# EAGLE design sensornode (EAGLE 6.4)
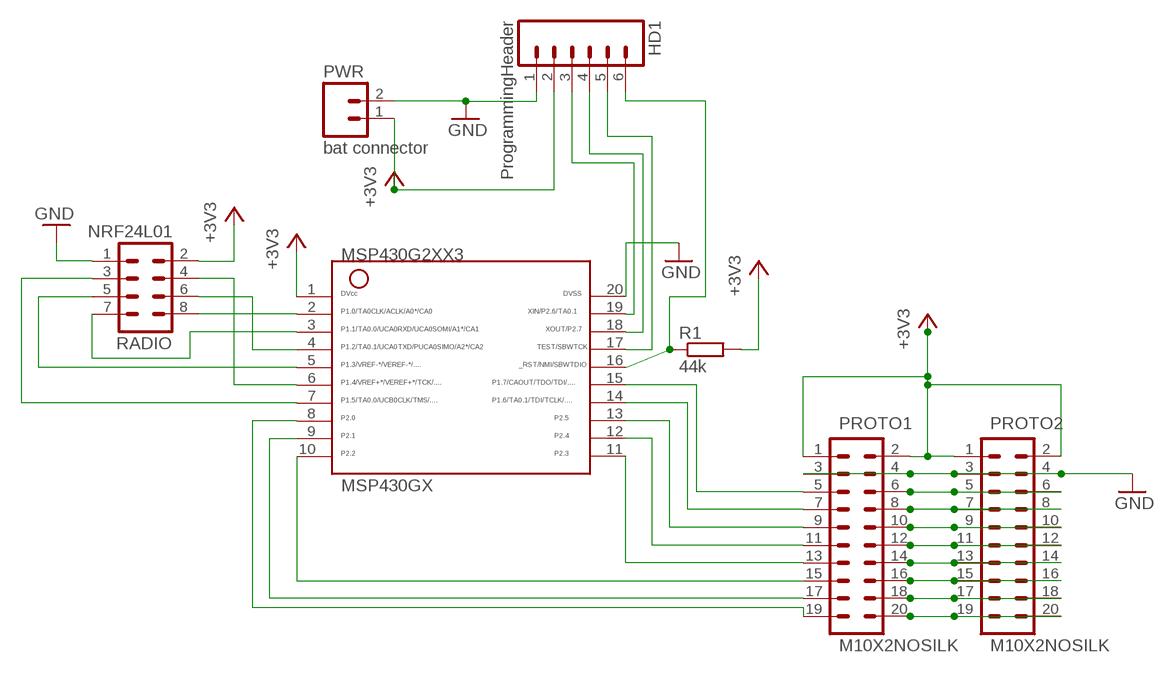
[diagram p0: schematic, sheet 1]

## Parts
HD1  ProgrammingHeader  M06SIP  [1X06]
MSP430GX  G2XX3---N20  [N20]
PROTO1  M10X2NOSILK  [2X10_NOSILK]
PROTO2  M10X2NOSILK  [2X10_NOSILK]
PWR  bat connector  M025MM  [SCREWTERMINAL-5MM-2]
R1  44k  R-EU_0207/10  [0207/10]
RADIO  NRF24L01  MA04-2  [MA04-2]

## Nets
+3V3: HD1.2 MSP430GX.1 PROTO1.1 PROTO1.2 PROTO2.1 PROTO2.2 PWR.1 R1.2 RADIO.2
GND: HD1.1 MSP430GX.20 PROTO1.3 PROTO1.4 PROTO2.3 PROTO2.4 PWR.2 RADIO.1
N$1: MSP430GX.6 RADIO.4
N$2: HD1.6 MSP430GX.16 R1.1
N$3: HD1.3 MSP430GX.19
N$4: MSP430GX.7 RADIO.3
N$5: MSP430GX.8 PROTO1.19
N$6: MSP430GX.5 RADIO.5
N$7: MSP430GX.4 RADIO.6
N$8: MSP430GX.3 RADIO.7
N$9: MSP430GX.9 PROTO1.17
N$10: MSP430GX.10 PROTO1.15
N$11: MSP430GX.11 PROTO1.13
N$12: MSP430GX.12 PROTO1.11
N$13: MSP430GX.13 PROTO1.9
N$14: MSP430GX.14 PROTO1.7
N$15: MSP430GX.15 PROTO1.5
N$16: MSP430GX.2 RADIO.8
N$17: HD1.4 MSP430GX.18
N$18: HD1.5 MSP430GX.17
N$19: PROTO1.6 PROTO2.5 PROTO2.6
N$20: PROTO1.8 PROTO2.7 PROTO2.8
N$21: PROTO1.10 PROTO2.9 PROTO2.10
N$22: PROTO1.12 PROTO2.11 PROTO2.12
N$23: PROTO1.14 PROTO2.13 PROTO2.14
N$24: PROTO1.16 PROTO2.15 PROTO2.16
N$25: PROTO1.18 PROTO2.17 PROTO2.18
N$26: PROTO1.20 PROTO2.19 PROTO2.20

## Library data of the parts
HD1 = SparkFun-Connectors:M06: Header 6 Standard 6-pin 0.1" header. Use with straight break away headers (SKU : PRT-00116), right angle break away headers (PRT-00553), swiss pins (PRT-00743), machine pins (PRT-00117), and female headers (PRT-00115). Molex polarized connector foot print use with SKU : PRT-08094 with associated crimp pins and housings. NOTES ON THE VARIANTS LOCK and LOCK_LONGPADS... This footprint was designed to help hold the alignment of a through-hole component (i.e. 6-pin header) while soldering it into place. You may notice that each hole has been shifted either up or down by 0.005 of an inch from it's more standard position (which is a perfectly straight line). This slight alteration caused the pins (the squares in the middle) to touch the edges of the holes. Because they are alternating, it causes a "brace" to hold the component in place. 0.005 has proven to be the perfect amount of "off-center" position when using our standard breakaway headers. Although looks a little odd when you look at the bare footprint, once you have a header in there, the alteration is very hard to notice. Also, if you push a header all the way into place, it is covered up entirely on the bottom side. This idea of altering the position of holes to aid alignment will be further integrated into the Sparkfun Library for other footprints. It can help hold any component with 3 or more connection pins.
MSP430GX = TI_MSP430_v16:G2XX3---N20: MSP430G2XX1 PDIP (N) 20 Pin Package
PROTO1 PROTO2 = SparkFun-Connectors:M10X2: This was SPECIALLY designed to be used with our Graphic LCD Backpack. Be sure you want to use this! It is not only staggered on each line of header holes, but IT IS ALSO offset of the center point of the top and bottom lines by 5 mil. This causes the headers to lock into place on the "standard" footprint on the LCD screen. The extra squares on the tdocu layer are there simply to reference other pins (if you were to actually populate a longer header than ten long - this is what we do with the backpacks).
PWR = SparkFun-Connectors:M02: Header 2 Standard 2-pin 0.1" header. Use with straight break away headers (SKU : PRT-00116), right angle break away headers (PRT-00553), swiss pins (PRT-00743), machine pins (PRT-00117), and female headers (PRT-00115). Molex polarized connector foot print use with SKU : PRT-08233 with associated crimp pins and housings.
R1 = resistor:R-EU_: RESISTOR, European symbol
RADIO = con-lstb:MA04-2: PIN HEADER; OC_FARNELL: unknown; OC_NEWARK: unknown

## Board
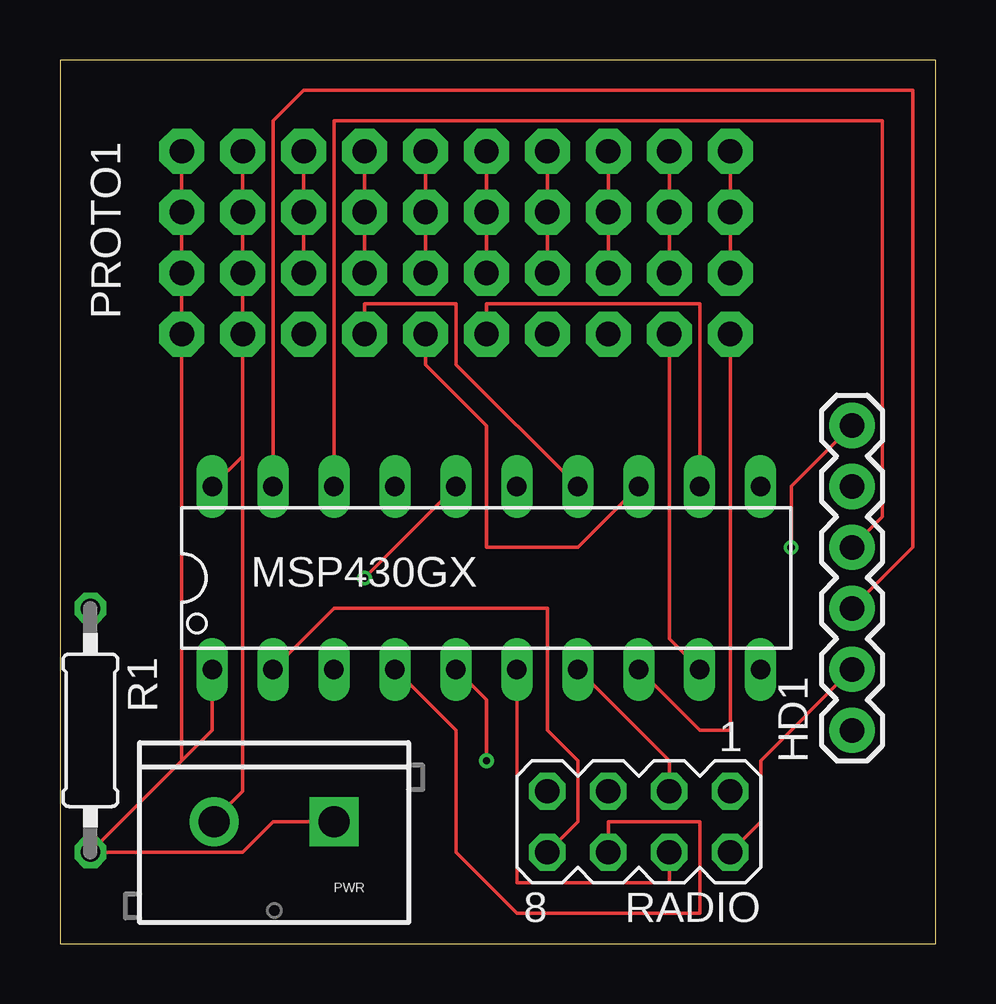
[diagram p1: board, top side]
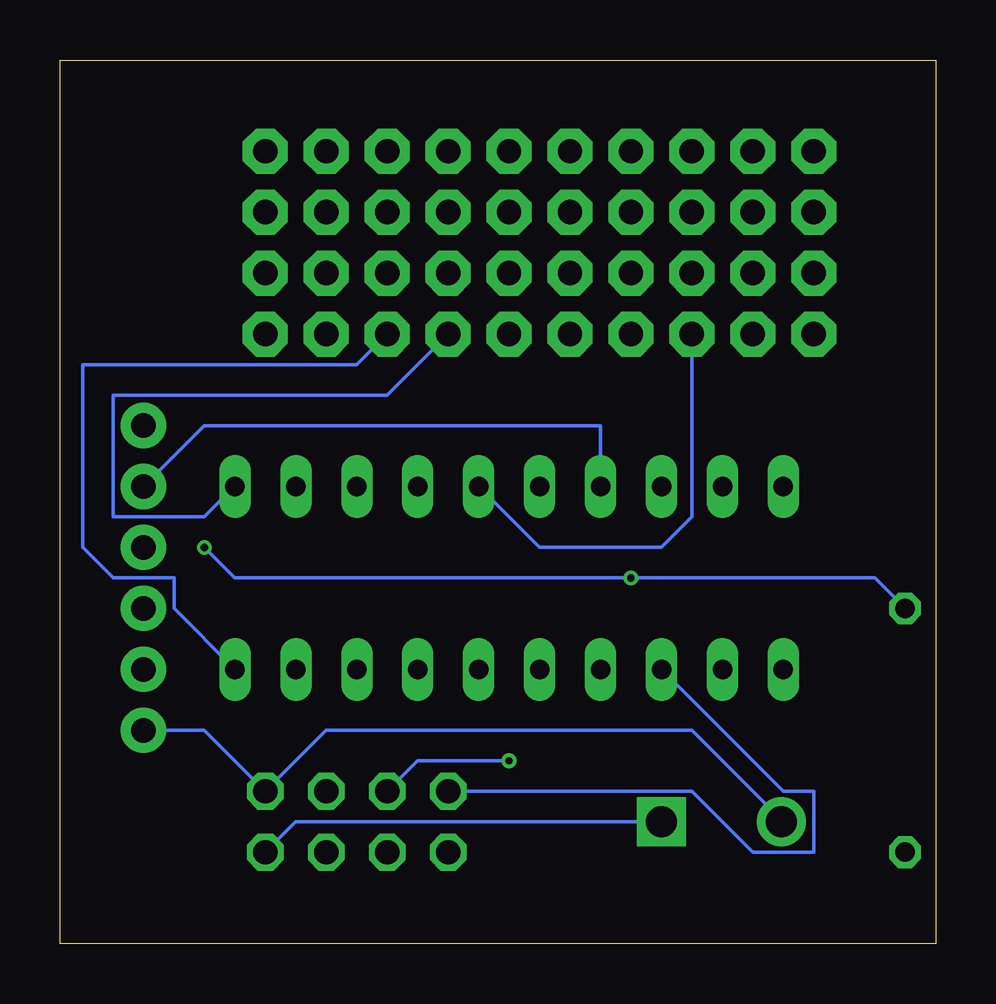
[diagram p2: board, bottom side, seen from below]

Size 36.5 x 36.82 mm. Coordinates in mm from the lower left corner, seen from the top.
Outline: 0,0 36.5,0 36.5,36.82 0,36.82 0,0
Copper layers (1*16): Top 0.035mm / dielectric 1.5mm / Bottom 0.035mm
Design rules "ITEADstudio_DRC": minimum track width 6mil, minimum drill 12mil, track to track 6mil, track to pad 6mil, pad to pad 6mil, via to via 6mil, smd to smd 0mil, copper to edge 10mil, drill to drill 10mil, minimum pad ring 10mil, minimum via ring 6mil, stop-mask expansion 2mil, vias tented up to drill 100mil, thermal gap 10mil

### Footprints (pad centres in the part's own frame; a part is rotated, then mirrored left to right if it is on the bottom)
1X06 = drill 1.016 pad 1.88: 1 0,0; 2 2.54,0; 3 5.08,0; 4 7.62,0; 5 10.16,0; 6 12.7,0
N20 = drill 0.813 long: 1 -11.435,-3.81; 2 -8.895,-3.81; 3 -6.355,-3.81; 4 -3.815,-3.81; 5 -1.275,-3.81; 6 1.265,-3.81; 7 3.805,-3.81; 8 6.345,-3.81; 9 8.885,-3.81; 10 11.425,-3.81; 11 11.425,3.81; 12 8.885,3.81; 13 6.345,3.81; 14 3.805,3.81; 15 1.265,3.81; 16 -1.275,3.81; 17 -3.815,3.81; 18 -6.355,3.81; 19 -8.895,3.81; 20 -11.435,3.81
2X10_NOSILK = drill 1.016 pad 1.88 octagon: 1 -11.43,-1.27; 2 -11.43,1.27; 3 -8.89,-1.27; 4 -8.89,1.27; 5 -6.35,-1.27; 6 -6.35,1.27; 7 -3.81,-1.27; 8 -3.81,1.27; 9 -1.27,-1.27; 10 -1.27,1.27; 11 1.27,-1.27; 12 1.27,1.27; 13 3.81,-1.27; 14 3.81,1.27; 15 6.35,-1.27; 16 6.35,1.27; 17 8.89,-1.27; 18 8.89,1.27; 19 11.43,-1.27; 20 11.43,1.27
SCREWTERMINAL-5MM-2 = drill 1.3 pad 2.032 square: 1 0,0 | drill 1.3 pad 2.032: 2 5,0
0207/10 = drill 0.813 octagon: 1 -5.08,0; 2 5.08,0
MA04-2 = drill 1.016 octagon: 1 -3.81,-1.27; 2 -3.81,1.27; 3 -1.27,-1.27; 4 -1.27,1.27; 5 1.27,-1.27; 6 1.27,1.27; 7 3.81,-1.27; 8 3.81,1.27

### Placement (x,y rotation side)
HD1  33.02,8.89 90 top
MSP430GX  17.78,15.24 0 top
PROTO1  16.51,26.67 0 top
PROTO2  16.51,31.75 0 top
PWR  11.43,5.08 180 top
R1  1.27,8.89 270 top
RADIO  24.13,5.08 180 top

### Tracks (layer width: path | path; a pad name or v marks a point on that pad's centre or on a via)
+3V3
  Top 0.152: HD1.2 29.21,7.62 29.21,5.08 RADIO.2 | PROTO2.2 PROTO2.1 PROTO1.2 PROTO1.1 5.08,7.62 | 5.08,7.62 6.35,8.89 MSP430GX.1 | 5.08,7.62 R1.2 7.62,3.81 8.89,5.08 PWR.1
  Bottom 0.152: RADIO.2 26.67,5.08 PWR.1
GND
  Top 0.152: PROTO2.4 PROTO2.3 PROTO1.4 PROTO1.3 7.62,20.32 | 7.62,20.32 MSP430GX.20 | 7.62,20.32 7.62,6.35 6.35,5.08 PWR.2
  Bottom 0.152: HD1.1 30.48,8.89 RADIO.1 25.4,8.89 10.16,8.89 6.35,5.08 PWR.2
N$1
  Top 0.152: RADIO.4 25.4,2.54 19.05,2.54 MSP430GX.6
N$2  (via drill 0.3)
  Top 0.152: v12.7,15.24 MSP430GX.16 | HD1.6 30.48,19.05 v30.48,16.51
  Bottom 0.152: R1.1 2.54,15.24 v12.7,15.24 29.21,15.24 v30.48,16.51
N$3
  Top 0.152: HD1.3 35.56,16.51 35.56,35.56 10.16,35.56 8.89,34.29 MSP430GX.19
N$4
  Top 0.152: RADIO.3 25.4,7.62 MSP430GX.7
N$5
  Top 0.152: PROTO1.19 27.94,8.89 26.67,8.89 MSP430GX.8
N$6  (via drill 0.3)
  Top 0.152: v17.78,7.62 17.78,10.16 MSP430GX.5
  Bottom 0.152: v17.78,7.62 21.59,7.62 RADIO.5
N$7
  Top 0.152: RADIO.6 22.86,5.08 26.67,5.08 26.67,1.27 19.05,1.27 16.51,3.81 16.51,8.89 MSP430GX.4
N$8
  Bottom 0.152: RADIO.7 10.16,6.35 7.62,3.81 5.08,3.81 5.08,6.35 6.35,6.35 MSP430GX.3
N$9
  Top 0.152: PROTO1.17 25.4,12.7 MSP430GX.9
N$10
  Bottom 0.152: PROTO1.15 24.13,24.13 35.56,24.13 35.56,16.51 34.29,15.24 31.75,15.24 31.75,13.97 MSP430GX.10
N$11
  Bottom 0.152: PROTO1.13 22.86,22.86 34.29,22.86 34.29,17.78 30.48,17.78 MSP430GX.11
N$12
  Top 0.152: PROTO1.11 17.78,26.67 26.67,26.67 MSP430GX.12
N$13
  Top 0.152: PROTO1.9 15.24,24.13 17.78,21.59 17.78,16.51 21.59,16.51 MSP430GX.13
N$14
  Top 0.152: PROTO1.7 12.7,26.67 16.51,26.67 16.51,24.13 MSP430GX.14
N$15
  Bottom 0.152: PROTO1.5 10.16,17.78 11.43,16.51 16.51,16.51 MSP430GX.15
N$16
  Top 0.152: RADIO.8 21.59,5.08 21.59,7.62 20.32,8.89 20.32,13.97 11.43,13.97 MSP430GX.2
N$17
  Top 0.152: HD1.4 34.29,17.78 34.29,34.29 11.43,34.29 MSP430GX.18
N$18
  Bottom 0.152: HD1.5 30.48,21.59 13.97,21.59 MSP430GX.17
N$19
  Top 0.152: PROTO1.6 PROTO2.5 PROTO2.6
N$20
  Top 0.152: PROTO1.8 PROTO2.7 PROTO2.8
N$21
  Top 0.152: PROTO1.10 PROTO2.9 PROTO2.10
N$22
  Top 0.152: PROTO1.12 PROTO2.11 PROTO2.12
N$23
  Top 0.152: PROTO1.14 PROTO2.13 PROTO2.14
N$24
  Top 0.152: PROTO1.16 PROTO2.15 PROTO2.16
N$25
  Top 0.152: PROTO1.18 PROTO2.17 PROTO2.18
N$26
  Top 0.152: PROTO1.20 PROTO2.19 PROTO2.20